# EAGLE design greenbox (EAGLE 7.5.0)
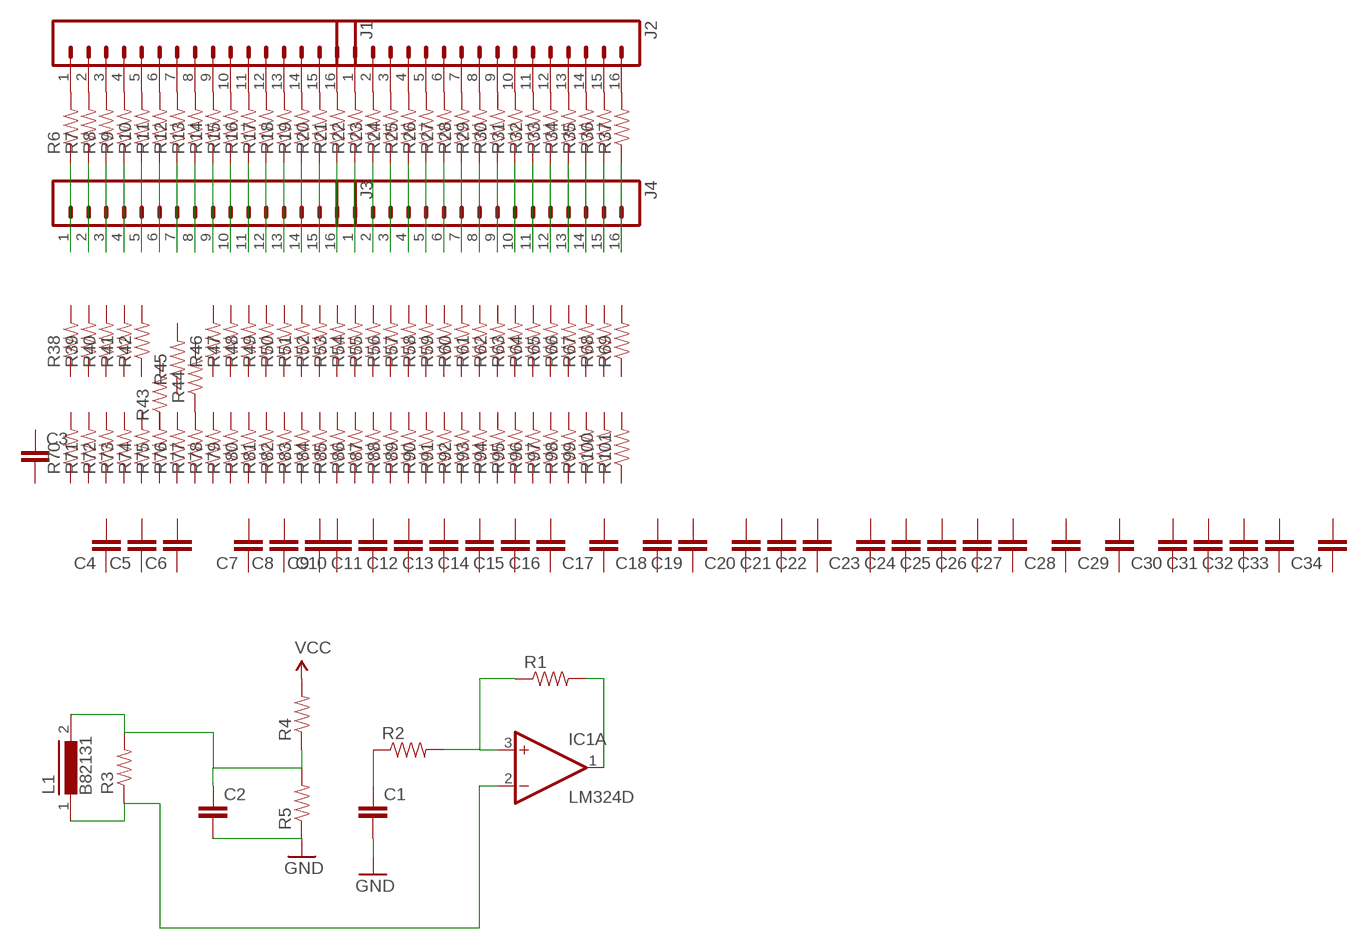
[diagram p0: schematic, sheet 1]

## Parts
C1  CAP0603-CAP  [0603-CAP]
C2  CAP0603-CAP  [0603-CAP]
C3  CAP0603-CAP  [0603-CAP]
C4  CAP0603-CAP  [0603-CAP]
C5  CAP0603-CAP  [0603-CAP]
C6  CAP0603-CAP  [0603-CAP]
C7  CAP0603-CAP  [0603-CAP]
C8  CAP0603-CAP  [0603-CAP]
C9  CAP0603-CAP  [0603-CAP]
C10  CAP0603-CAP  [0603-CAP]
C11  CAP0603-CAP  [0603-CAP]
C12  CAP0603-CAP  [0603-CAP]
C13  CAP0603-CAP  [0603-CAP]
C14  CAP0603-CAP  [0603-CAP]
C15  CAP0603-CAP  [0603-CAP]
C16  CAP0603-CAP  [0603-CAP]
C17  CAP0603-CAP  [0603-CAP]
C18  CAP0603-CAP  [0603-CAP]
C19  CAP0603-CAP  [0603-CAP]
C20  CAP0603-CAP  [0603-CAP]
C21  CAP0603-CAP  [0603-CAP]
C22  CAP0603-CAP  [0603-CAP]
C23  CAP0603-CAP  [0603-CAP]
C24  CAP0603-CAP  [0603-CAP]
C25  CAP0603-CAP  [0603-CAP]
C26  CAP0603-CAP  [0603-CAP]
C27  CAP0603-CAP  [0603-CAP]
C28  CAP0603-CAP  [0603-CAP]
C29  CAP0603-CAP  [0603-CAP]
C30  CAP0603-CAP  [0603-CAP]
C31  CAP0603-CAP  [0603-CAP]
C32  CAP0603-CAP  [0603-CAP]
C33  CAP0603-CAP  [0603-CAP]
C34  CAP0603-CAP  [0603-CAP]
IC1  LM324D  [SO14]
J1  M16LOCK  [1X16_LOCK]
J2  M16LOCK  [1X16_LOCK]
J3  M16LOCK  [1X16_LOCK]
J4  M16LOCK  [1X16_LOCK]
L1  B82131  [SUKW1-17]
R1  RESISTOR0603  [0603-RES]
R2  RESISTOR0603  [0603-RES]
R3  RESISTOR0603-RES  [0603-RES]
R4  RESISTOR0603-RES  [0603-RES]
R5  RESISTOR0603-RES  [0603-RES]
R6  RESISTOR0603-RES  [0603-RES]
R7  RESISTOR0603-RES  [0603-RES]
R8  RESISTOR0603-RES  [0603-RES]
R9  RESISTOR0603-RES  [0603-RES]
R10  RESISTOR0603-RES  [0603-RES]
R11  RESISTOR0603-RES  [0603-RES]
R12  RESISTOR0603-RES  [0603-RES]
R13  RESISTOR0603-RES  [0603-RES]
R14  RESISTOR0603-RES  [0603-RES]
R15  RESISTOR0603-RES  [0603-RES]
R16  RESISTOR0603-RES  [0603-RES]
R17  RESISTOR0603-RES  [0603-RES]
R18  RESISTOR0603-RES  [0603-RES]
R19  RESISTOR0603-RES  [0603-RES]
R20  RESISTOR0603-RES  [0603-RES]
R21  RESISTOR0603-RES  [0603-RES]
R22  RESISTOR0603-RES  [0603-RES]
R23  RESISTOR0603-RES  [0603-RES]
R24  RESISTOR0603-RES  [0603-RES]
R25  RESISTOR0603-RES  [0603-RES]
R26  RESISTOR0603-RES  [0603-RES]
R27  RESISTOR0603-RES  [0603-RES]
R28  RESISTOR0603-RES  [0603-RES]
R29  RESISTOR0603-RES  [0603-RES]
R30  RESISTOR0603-RES  [0603-RES]
R31  RESISTOR0603-RES  [0603-RES]
R32  RESISTOR0603-RES  [0603-RES]
R33  RESISTOR0603-RES  [0603-RES]
R34  RESISTOR0603-RES  [0603-RES]
R35  RESISTOR0603-RES  [0603-RES]
R36  RESISTOR0603-RES  [0603-RES]
R37  RESISTOR0603-RES  [0603-RES]
R38  RESISTOR0603-RES  [0603-RES]
R39  RESISTOR0603-RES  [0603-RES]
R40  RESISTOR0603-RES  [0603-RES]
R41  RESISTOR0603-RES  [0603-RES]
R42  RESISTOR0603-RES  [0603-RES]
R43  RESISTOR0603-RES  [0603-RES]
R44  RESISTOR0603-RES  [0603-RES]
R45  RESISTOR0603-RES  [0603-RES]
R46  RESISTOR0603-RES  [0603-RES]
R47  RESISTOR0603-RES  [0603-RES]
R48  RESISTOR0603-RES  [0603-RES]
R49  RESISTOR0603-RES  [0603-RES]
R50  RESISTOR0603-RES  [0603-RES]
R51  RESISTOR0603-RES  [0603-RES]
R52  RESISTOR0603-RES  [0603-RES]
R53  RESISTOR0603-RES  [0603-RES]
R54  RESISTOR0603-RES  [0603-RES]
R55  RESISTOR0603-RES  [0603-RES]
R56  RESISTOR0603-RES  [0603-RES]
R57  RESISTOR0603-RES  [0603-RES]
R58  RESISTOR0603-RES  [0603-RES]
R59  RESISTOR0603-RES  [0603-RES]
R60  RESISTOR0603-RES  [0603-RES]
R61  RESISTOR0603-RES  [0603-RES]
R62  RESISTOR0603-RES  [0603-RES]
R63  RESISTOR0603-RES  [0603-RES]
R64  RESISTOR0603-RES  [0603-RES]
R65  RESISTOR0603-RES  [0603-RES]
R66  RESISTOR0603-RES  [0603-RES]
R67  RESISTOR0603-RES  [0603-RES]
R68  RESISTOR0603-RES  [0603-RES]
R69  RESISTOR0603-RES  [0603-RES]
R70  RESISTOR0603-RES  [0603-RES]
R71  RESISTOR0603-RES  [0603-RES]
R72  RESISTOR0603-RES  [0603-RES]
R73  RESISTOR0603-RES  [0603-RES]
R74  RESISTOR0603-RES  [0603-RES]
R75  RESISTOR0603-RES  [0603-RES]
R76  RESISTOR0603-RES  [0603-RES]
R77  RESISTOR0603-RES  [0603-RES]
R78  RESISTOR0603-RES  [0603-RES]
R79  RESISTOR0603-RES  [0603-RES]
R80  RESISTOR0603-RES  [0603-RES]
R81  RESISTOR0603-RES  [0603-RES]
R82  RESISTOR0603-RES  [0603-RES]
R83  RESISTOR0603-RES  [0603-RES]
R84  RESISTOR0603-RES  [0603-RES]
R85  RESISTOR0603-RES  [0603-RES]
R86  RESISTOR0603-RES  [0603-RES]
R87  RESISTOR0603-RES  [0603-RES]
R88  RESISTOR0603-RES  [0603-RES]
R89  RESISTOR0603-RES  [0603-RES]
R90  RESISTOR0603-RES  [0603-RES]
R91  RESISTOR0603-RES  [0603-RES]
R92  RESISTOR0603-RES  [0603-RES]
R93  RESISTOR0603-RES  [0603-RES]
R94  RESISTOR0603-RES  [0603-RES]
R95  RESISTOR0603-RES  [0603-RES]
R96  RESISTOR0603-RES  [0603-RES]
R97  RESISTOR0603-RES  [0603-RES]
R98  RESISTOR0603-RES  [0603-RES]
R99  RESISTOR0603-RES  [0603-RES]
R100  RESISTOR0603-RES  [0603-RES]
R101  RESISTOR0603-RES  [0603-RES]

## Nets
GND: C1.2 C2.2 R5.1
N$1: IC1.1(A:OUT) R1.2
N$2: C2.1 L1.2 R3.2 R4.1 R5.2
N$3: C1.1 R2.1
N$4: IC1.2(A:-IN) L1.1 R3.1
N$5: R44.1 R77.2
N$6: J3.1 R6.1
N$7: J3.2 R7.1
N$8: J3.3 R8.1
N$9: J3.4 R9.1
N$10: J3.5 R10.1
N$11: J3.6 R11.1
N$12: J3.7 R12.1
N$13: J3.8 R13.1
N$14: J3.9 R14.1
N$15: J3.10 R15.1
N$16: J3.11 R16.1
N$17: J3.12 R17.1
N$18: J3.13 R18.1
N$19: J3.14 R19.1
N$20: J3.15 R20.1
N$21: J3.16 R21.1
N$22: J4.1 R22.1
N$23: J4.2 R23.1
N$24: J4.3 R24.1
N$25: J4.4 R25.1
N$26: J4.5 R26.1
N$27: J4.6 R27.1
N$28: J4.7 R28.1
N$29: J4.8 R29.1
N$30: J4.9 R30.1
N$31: J4.10 R31.1
N$32: J4.11 R32.1
N$33: J4.12 R33.1
N$34: J4.13 R34.1
N$35: J4.14 R35.1
N$36: J4.15 R36.1
N$37: J4.16 R37.1
N$38: J1.1 R6.2
N$39: J1.2 R7.2
N$40: J1.3 R8.2
N$41: J1.4 R9.2
N$42: J1.5 R10.2
N$43: J1.6 R11.2
N$44: J1.7 R12.2
N$45: J1.8 R13.2
N$46: J1.9 R14.2
N$47: J1.10 R15.2
N$48: J1.11 R16.2
N$49: J1.12 R17.2
N$50: J1.13 R18.2
N$51: J1.14 R19.2
N$52: J1.15 R20.2
N$53: J1.16 R21.2
N$54: J2.1 R22.2
N$55: J2.2 R23.2
N$56: J2.3 R24.2
N$57: J2.4 R25.2
N$58: J2.5 R26.2
N$59: J2.6 R27.2
N$60: J2.7 R28.2
N$61: J2.8 R29.2
N$62: J2.9 R30.2
N$63: J2.10 R31.2
N$64: J2.11 R32.2
N$65: J2.12 R33.2
N$66: J2.13 R34.2
N$67: J2.14 R35.2
N$68: J2.15 R36.2
N$69: J2.16 R37.2
VCC: R4.2
VIN: IC1.3(A:+IN) R1.1 R2.2
Unconnected: C3.1 C3.2 C4.1 C4.2 C5.1 C5.2 C6.1 C6.2 C7.1 C7.2 C8.1 C8.2 C9.1 C9.2 C10.1 C10.2 C11.1 C11.2 C12.1 C12.2 C13.1 C13.2 C14.1 C14.2 C15.1 C15.2 C16.1 C16.2 C17.1 C17.2 C18.1 C18.2 C19.1 C19.2 C20.1 C20.2 C21.1 C21.2 C22.1 C22.2 C23.1 C23.2 C24.1 C24.2 C25.1 C25.2 C26.1 C26.2 C27.1 C27.2 C28.1 C28.2 C29.1 C29.2 C30.1 C30.2 C31.1 C31.2 C32.1 C32.2 C33.1 C33.2 C34.1 C34.2 IC1.5(B:+IN) IC1.6(B:-IN) IC1.7(B:OUT) IC1.8(C:OUT) IC1.9(C:-IN) IC1.10(C:+IN) IC1.12(D:+IN) IC1.13(D:-IN) IC1.14(D:OUT) R38.1 R38.2 R39.1 R39.2 R40.1 R40.2 R41.1 R41.2 R42.1 R42.2 R43.1 R43.2 R44.2 R45.1 R45.2 R46.1 R46.2 R47.1 R47.2 R48.1 R48.2 R49.1 R49.2 R50.1 R50.2 R51.1 R51.2 R52.1 R52.2 R53.1 R53.2 R54.1 R54.2 R55.1 R55.2 R56.1 R56.2 R57.1 R57.2 R58.1 R58.2 R59.1 R59.2 R60.1 R60.2 R61.1 R61.2 R62.1 R62.2 R63.1 R63.2 R64.1 R64.2 R65.1 R65.2 R66.1 R66.2 R67.1 R67.2 R68.1 R68.2 R69.1 R69.2 R70.1 R70.2 R71.1 R71.2 R72.1 R72.2 R73.1 R73.2 R74.1 R74.2 R75.1 R75.2 R76.1 R76.2 R77.1 R78.1 R78.2 R79.1 R79.2 R80.1 R80.2 R81.1 R81.2 R82.1 R82.2 R83.1 R83.2 R84.1 R84.2 R85.1 R85.2 R86.1 R86.2 R87.1 R87.2 R88.1 R88.2 R89.1 R89.2 R90.1 R90.2 R91.1 R91.2 R92.1 R92.2 R93.1 R93.2 R94.1 R94.2 R95.1 R95.2 R96.1 R96.2 R97.1 R97.2 R98.1 R98.2 R99.1 R99.2 R100.1 R100.2 R101.1 R101.2

## Power pins joined to a net without a drawn wire
V+: IC1.4(P:V+)
V-: IC1.11(P:V-)

## Library data of the parts
C1 C2 = SparkFun-Passives:CAP: Capacitor Standard 0603 ceramic capacitor, and 0.1" leaded capacitor.
C3-C34 = SparkFun-Capacitors:CAP: Capacitor Standard 0603 ceramic capacitor, and 0.1" leaded capacitor.
IC1 = linear:LM324: OP AMP
J1-J4 = SparkFun-Connectors:M16: 1x16 .1" header
L1 = inductors:B82131: INDUCTOR
R1 R2 = SparkFun-Resistors:RESISTOR: Resistor Basic schematic elements and footprints for 0603, 1206, and PTH resistors.
R3-R101 = SparkFun-Passives:RESISTOR: Resistor Basic schematic elements and footprints for 0603, 1206, and PTH resistors.

## Board
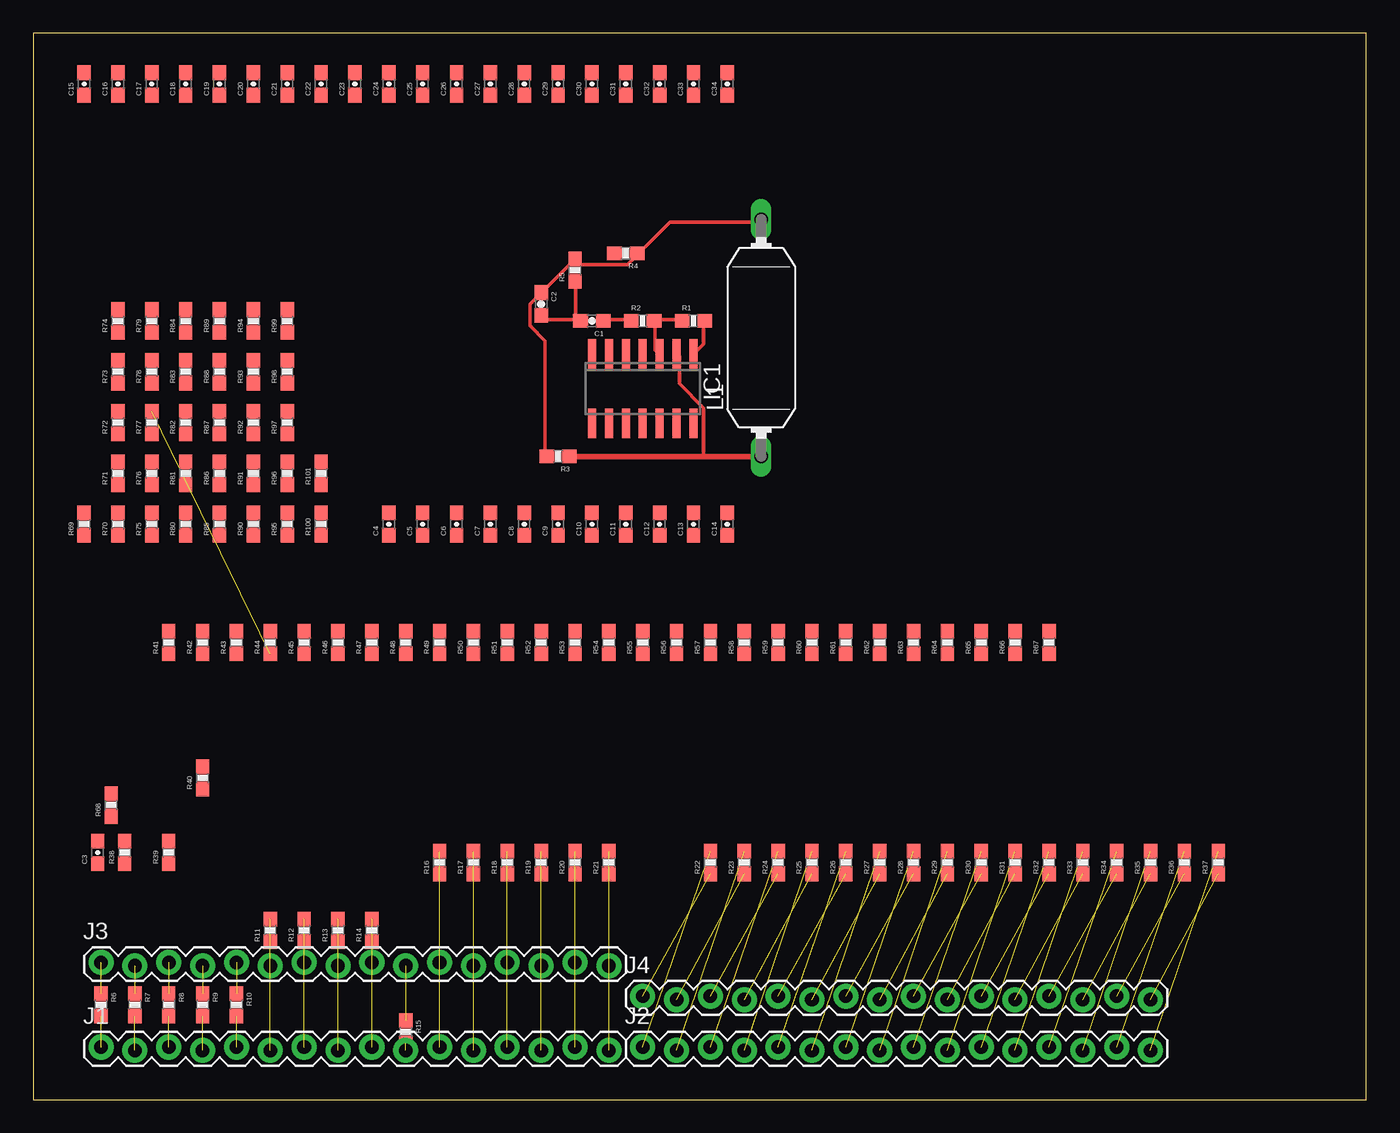
[diagram p1: board, top side]

Size 100 x 80 mm. Coordinates in mm from the lower left corner, seen from the top.
Outline: 0,0 100,0 100,80 0,80 0,0
Copper layers (1*16): Top 0.035mm / dielectric 1.5mm / Bottom 0.035mm
Design rules "default": minimum track width 10mil, minimum drill 24mil, track to track 8mil, track to pad 8mil, pad to pad 8mil, via to via 8mil, smd to smd 8mil, copper to edge 40mil, drill to drill 8mil, minimum pad ring 10mil, minimum via ring 8mil, stop-mask expansion 4mil, vias tented up to drill 0mil, thermal gap 10mil

### Footprints (pad centres in the part's own frame; a part is rotated, then mirrored left to right if it is on the bottom)
0603-CAP = smd 1.1 x 1: 1 -0.85,0; 2 0.85,0
SO14 = smd 0.6 x 2.2: 1 -3.81,-2.6; 2 -2.54,-2.6; 3 -1.27,-2.6; 4 0,-2.6; 5 1.27,-2.6; 6 2.54,-2.6; 7 3.81,-2.6; 8 3.81,2.6; 9 2.54,2.6; 10 1.27,2.6; 11 0,2.6; 12 -1.27,2.6; 13 -2.54,2.6; 14 -3.81,2.6
1X16_LOCK = drill 1.016 pad 1.88: 1 0,0.127; 2 2.54,-0.127; 3 5.08,0.127; 4 7.62,-0.127; 5 10.16,0.127; 6 12.7,-0.127; 7 15.24,0.127; 8 17.78,-0.127; 9 20.32,0.127; 10 22.86,-0.127; 11 25.4,0.127; 12 27.94,-0.127; 13 30.48,0.127; 14 33.02,-0.127; 15 35.56,0.127; 16 38.1,-0.127
SUKW1-17 = drill 1.016 long: 1 -8.89,0; 2 8.89,0
0603-RES = smd 1.1 x 1: 1 -0.85,0; 2 0.85,0

### Placement (x,y rotation side)
C1  41.91,58.42 180 top
C2  38.1,59.69 270 top
C3  4.83,18.54 90 top
C4  26.67,43.18 90 top
C5  29.21,43.18 90 top
C6  31.75,43.18 90 top
C7  34.29,43.18 90 top
C8  36.83,43.18 90 top
C9  39.37,43.18 90 top
C10  41.91,43.18 90 top
C11  44.45,43.18 90 top
C12  46.99,43.18 90 top
C13  49.53,43.18 90 top
C14  52.07,43.18 90 top
C15  3.81,76.2 90 top
C16  6.35,76.2 90 top
C17  8.89,76.2 90 top
C18  11.43,76.2 90 top
C19  13.97,76.2 90 top
C20  16.51,76.2 90 top
C21  19.05,76.2 90 top
C22  21.59,76.2 90 top
C23  24.13,76.2 90 top
C24  26.67,76.2 90 top
C25  29.21,76.2 90 top
C26  31.75,76.2 90 top
C27  34.29,76.2 90 top
C28  36.83,76.2 90 top
C29  39.37,76.2 90 top
C30  41.91,76.2 90 top
C31  44.45,76.2 90 top
C32  46.99,76.2 90 top
C33  49.53,76.2 90 top
C34  52.07,76.2 90 top
IC1  45.72,53.34 180 top
J1  5.08,3.81 0 top
J2  45.72,3.81 0 top
J3  5.08,10.16 0 top
J4  45.72,7.62 0 top
L1  54.61,57.15 90 top
R1  49.53,58.42 0 top
R2  45.72,58.42 0 top
R3  39.37,48.26 180 top
R4  44.45,63.5 180 top
R5  40.64,62.23 90 top
R6  5.08,7.11 270 top
R7  7.62,7.11 270 top
R8  10.16,7.11 270 top
R9  12.7,7.11 270 top
R10  15.24,7.11 270 top
R11  17.78,12.7 90 top
R12  20.32,12.7 90 top
R13  22.86,12.7 90 top
R14  25.4,12.7 90 top
R15  27.94,5.08 270 top
R16  30.48,17.78 90 top
R17  33.02,17.78 90 top
R18  35.56,17.78 90 top
R19  38.1,17.78 90 top
R20  40.64,17.78 90 top
R21  43.18,17.78 90 top
R22  50.8,17.78 90 top
R23  53.34,17.78 90 top
R24  55.88,17.78 90 top
R25  58.42,17.78 90 top
R26  60.96,17.78 90 top
R27  63.5,17.78 90 top
R28  66.04,17.78 90 top
R29  68.58,17.78 90 top
R30  71.12,17.78 90 top
R31  73.66,17.78 90 top
R32  76.2,17.78 90 top
R33  78.74,17.78 90 top
R34  81.28,17.78 90 top
R35  83.82,17.78 90 top
R36  86.36,17.78 90 top
R37  88.9,17.78 90 top
R38  6.86,18.54 90 top
R39  10.16,18.54 90 top
R40  12.7,24.13 90 top
R41  10.16,34.29 90 top
R42  12.7,34.29 90 top
R43  15.24,34.29 90 top
R44  17.78,34.29 90 top
R45  20.32,34.29 90 top
R46  22.86,34.29 90 top
R47  25.4,34.29 90 top
R48  27.94,34.29 90 top
R49  30.48,34.29 90 top
R50  33.02,34.29 90 top
R51  35.56,34.29 90 top
R52  38.1,34.29 90 top
R53  40.64,34.29 90 top
R54  43.18,34.29 90 top
R55  45.72,34.29 90 top
R56  48.26,34.29 90 top
R57  50.8,34.29 90 top
R58  53.34,34.29 90 top
R59  55.88,34.29 90 top
R60  58.42,34.29 90 top
R61  60.96,34.29 90 top
R62  63.5,34.29 90 top
R63  66.04,34.29 90 top
R64  68.58,34.29 90 top
R65  71.12,34.29 90 top
R66  73.66,34.29 90 top
R67  76.2,34.29 90 top
R68  5.84,22.1 90 top
R69  3.81,43.18 90 top
R70  6.35,43.18 90 top
R71  6.35,46.99 90 top
R72  6.35,50.8 90 top
R73  6.35,54.61 90 top
R74  6.35,58.42 90 top
R75  8.89,43.18 90 top
R76  8.89,46.99 90 top
R77  8.89,50.8 90 top
R78  8.89,54.61 90 top
R79  8.89,58.42 90 top
R80  11.43,43.18 90 top
R81  11.43,46.99 90 top
R82  11.43,50.8 90 top
R83  11.43,54.61 90 top
R84  11.43,58.42 90 top
R85  13.97,43.18 90 top
R86  13.97,46.99 90 top
R87  13.97,50.8 90 top
R88  13.97,54.61 90 top
R89  13.97,58.42 90 top
R90  16.51,43.18 90 top
R91  16.51,46.99 90 top
R92  16.51,50.8 90 top
R93  16.51,54.61 90 top
R94  16.51,58.42 90 top
R95  19.05,43.18 90 top
R96  19.05,46.99 90 top
R97  19.05,50.8 90 top
R98  19.05,54.61 90 top
R99  19.05,58.42 90 top
R100  21.59,43.18 90 top
R101  21.59,46.99 90 top

### Tracks (layer width: path | path; a pad name or v marks a point on that pad's centre or on a via)
GND
  Top 0.254: 40.69,58.52 38.41,58.52 38.18,58.75 C2.2 | 40.69,58.52 40.92,58.52 C1.2 40.69,58.52 | 40.69,58.52 40.69,61.27 R5.1
N$1
  Top 0.254: R1.2 50.29,58.29 50.29,56.69 49.61,56.01 IC1.1
N$2
  Top 0.254: R3.2 38.41,48.46 38.41,56.92 37.26,58.06 37.26,59.66 37.95,60.35 C2.1 38.18,60.58 40.46,62.87 R5.2 40.69,62.87 40.92,62.64 44.58,62.64 45.26,63.32 R4.1 45.49,63.55 47.78,65.84 54.41,65.84 L1.2
N$3
  Top 0.254: C1.1 42.98,58.52 44.81,58.52 R2.1
N$4
  Top 0.254: IC1.2 48.46,55.78 48.46,53.72 50.29,51.89 50.29,48.26 50.29,48.23
  Top 0.406: L1.1 50.29,48.26 R3.1
N$5  (1 unrouted)
N$6  (1 unrouted)
N$7  (1 unrouted)
N$8  (1 unrouted)
N$9  (1 unrouted)
N$10  (1 unrouted)
N$11  (1 unrouted)
N$12  (1 unrouted)
N$13  (1 unrouted)
N$14  (1 unrouted)
N$15  (1 unrouted)
N$16  (1 unrouted)
N$17  (1 unrouted)
N$18  (1 unrouted)
N$19  (1 unrouted)
N$20  (1 unrouted)
N$21  (1 unrouted)
N$22  (1 unrouted)
N$23  (1 unrouted)
N$24  (1 unrouted)
N$25  (1 unrouted)
N$26  (1 unrouted)
N$27  (1 unrouted)
N$28  (1 unrouted)
N$29  (1 unrouted)
N$30  (1 unrouted)
N$31  (1 unrouted)
N$32  (1 unrouted)
N$33  (1 unrouted)
N$34  (1 unrouted)
N$35  (1 unrouted)
N$36  (1 unrouted)
N$37  (1 unrouted)
N$38  (1 unrouted)
N$39  (1 unrouted)
N$40  (1 unrouted)
N$41  (1 unrouted)
N$42  (1 unrouted)
N$43  (1 unrouted)
N$44  (1 unrouted)
N$45  (1 unrouted)
N$46  (1 unrouted)
N$47  (1 unrouted)
N$48  (1 unrouted)
N$49  (1 unrouted)
N$50  (1 unrouted)
N$51  (1 unrouted)
N$52  (1 unrouted)
N$53  (1 unrouted)
N$54  (1 unrouted)
N$55  (1 unrouted)
N$56  (1 unrouted)
N$57  (1 unrouted)
N$58  (1 unrouted)
N$59  (1 unrouted)
N$60  (1 unrouted)
N$61  (1 unrouted)
N$62  (1 unrouted)
N$63  (1 unrouted)
N$64  (1 unrouted)
N$65  (1 unrouted)
N$66  (1 unrouted)
N$67  (1 unrouted)
N$68  (1 unrouted)
N$69  (1 unrouted)
VIN
  Top 0.254: R1.1 48.46,58.52 46.63,58.52 R2.2 46.63,58.29 46.63,56.24 46.86,56.01 IC1.3